# Altium schematic sheet Relay.SchDoc
size A; SheetNumber: 2; SheetTotal: 2
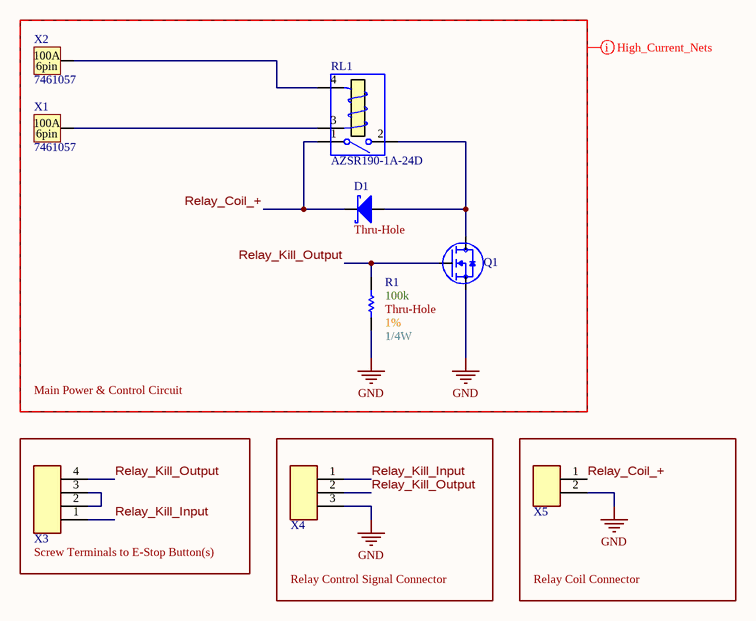
[diagram p0: Relay.SchDoc]

## Parts
D1  Footprint: Thru-Hole  [[Diode] Thru-Hole]  (hidden comment: 1N5822)
Q1  [NMOS] SMD 20V 1.4A 160mOhm  [SOT323]  (value not drawn)
R1  Size Package: Thru-Hole  Wattage: 1/4W  Tolerance: 1%  Resistance: 100k  [[Res] Thru-Hole 1/4W]  (hidden comment: [100k] Thru-Hole 1% 1/4W)
RL1  AZSR190-1A-24D  [[Relay] AZSR190-1A-24D]
X1  7461057  [[Port] Shank Connector (100A)]
X2  7461057  [[Port] Shank Connector (100A)]
X3  4pin Screw Terminal  [[Screw Terminal] 4pin 5mm]  (value not drawn)
X4  [Sherlock] 3pin  [[Sherlock] 3pin]  (value not drawn)
X5  2pin Screw Terminal  [[Screw Terminal] 2pin 5mm]  (value not drawn)

## Blocks framed on the sheet
Main Power & Control Circuit: D1 Q1 R1 RL1 X1 X2
Screw Terminals to E-Stop Button(s): X3
Relay Control Signal Connector: X4
Relay Coil Connector: X5

## Nets
GND: Q1.2(Source) R1.1 X4.3 X5.2
Relay_Coil_+: D1.1(K) RL1.1 X5.1
Relay_Kill_Input: X3.1 X4.1
Relay_Kill_Output: Q1.1(Gate) R1.2 X3.4 X4.2
NetD1_2: D1.2(A) Q1.3(Drain) RL1.2
NetRL1_3: RL1.3(T1) X1.1
NetRL1_4: RL1.4(T2) X2.1
NetX3_2: X3.2 X3.3

## Layout directives
net class High_Current_Nets: GND, Relay_Coil_+, Relay_Kill_Output

## Notes on the sheet
- (in symbol [Port] Shank Connector (100A)) 100A; 6pin

## Library data of the parts
D1 = [Schottky] Thru-Hole 40V 3A: Supplier 1: DigiKey; Supplier Part Number 1: 1N5822GOS-ND
Q1 = [NMOS] SMD 20V 1.4A 160mOhm: BSS816NWH6327XTSA1; Supplier 1: DigiKey; Supplier Part Number 1: BSS816NWH6327XTSA1CT-ND
R1 = [100k] Thru-Hole 1% 1/4W: MFR-25FTF52-100K; Supplier 1: DigiKey; Supplier Part Number 1: 13-MFR-25FTF52-100KCT-ND
RL1 = [Relay] AZSR190-1A-24D: Supplier 1: DigiKey; Supplier Part Number 1: 3385-AZSR190-1A-24D-ND
X1 X2 = [Port] Shank Connector (100A): 7461057, internal thread; Supplier 1: DigiKey; Supplier Part Number 1: 732-7461057-ND
X3 = [Screw Terminal] 4pin: TB002-500-04BE; Supplier 1: DigiKey; Supplier Part Number 1: 102-6147-ND
X4 = [Sherlock] 3pin: 0353620350; Supplier 1: DigiKey; Supplier Part Number 1: WM18921-ND
X5 = [Screw Terminal] 2pin: TB002-500-02BE; Supplier 1: DigiKey; Supplier Part Number 1: 102-6145-ND